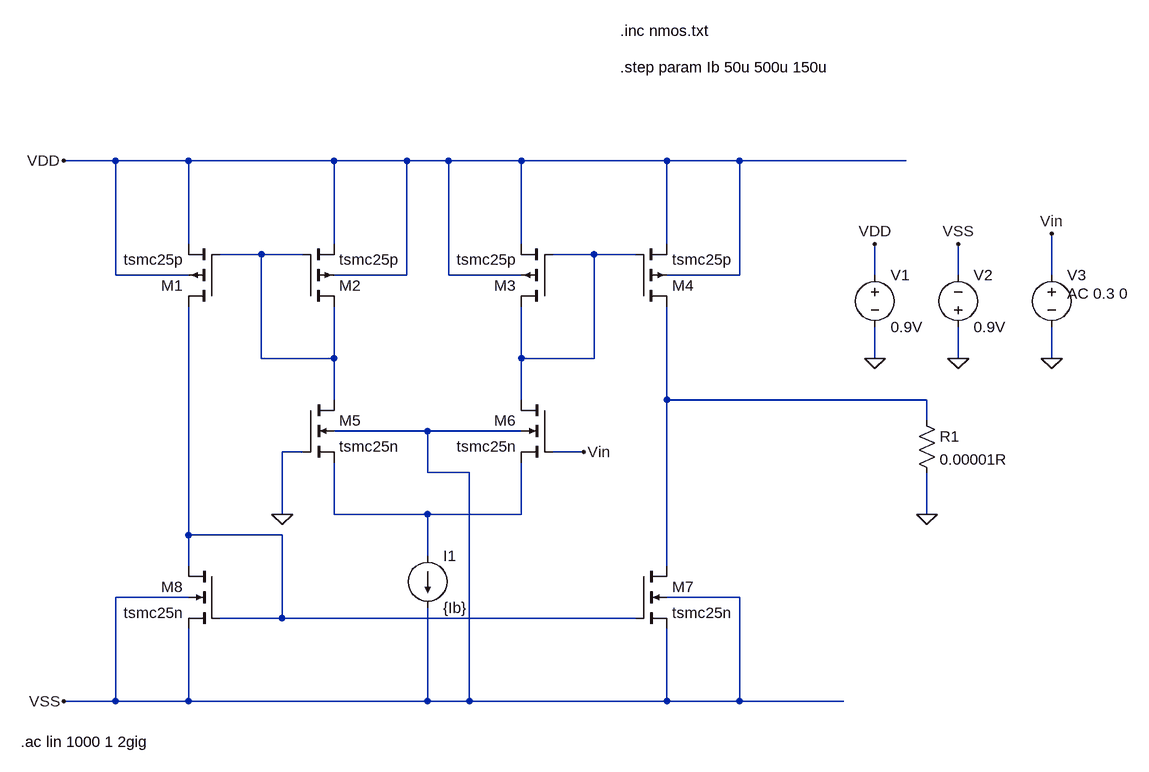
[diagram p0: schematic HW3.asc]
HW3.asc, the LTspice schematic file:
Version 4
SHEET 1 2160 680
WIRE 320 -368 240 -368
WIRE 432 -368 320 -368
WIRE 656 -368 432 -368
WIRE 768 -368 656 -368
WIRE 832 -368 768 -368
WIRE 944 -368 832 -368
WIRE 1168 -368 944 -368
WIRE 1280 -368 1168 -368
WIRE 1536 -368 1280 -368
WIRE 432 -240 432 -368
WIRE 656 -240 656 -368
WIRE 944 -240 944 -368
WIRE 1168 -240 1168 -368
WIRE 544 -224 480 -224
WIRE 608 -224 544 -224
WIRE 1056 -224 992 -224
WIRE 1120 -224 1056 -224
WIRE 320 -192 320 -368
WIRE 432 -192 320 -192
WIRE 768 -192 768 -368
WIRE 768 -192 656 -192
WIRE 832 -192 832 -368
WIRE 944 -192 832 -192
WIRE 1280 -192 1280 -368
WIRE 1280 -192 1168 -192
WIRE 1488 -192 1488 -240
WIRE 1616 -192 1616 -240
WIRE 1760 -192 1760 -256
WIRE 544 -64 544 -224
WIRE 656 -64 656 -144
WIRE 656 -64 544 -64
WIRE 944 -64 944 -144
WIRE 1056 -64 1056 -224
WIRE 1056 -64 944 -64
WIRE 1488 -64 1488 -112
WIRE 1616 -64 1616 -112
WIRE 1760 -64 1760 -112
WIRE 656 0 656 -64
WIRE 944 0 944 -64
WIRE 1168 0 1168 -144
WIRE 1568 0 1168 0
WIRE 1568 32 1568 0
WIRE 800 48 656 48
WIRE 944 48 800 48
WIRE 608 80 576 80
WIRE 1040 80 992 80
WIRE 800 112 800 48
WIRE 864 112 800 112
WIRE 576 176 576 80
WIRE 656 176 656 96
WIRE 800 176 656 176
WIRE 944 176 944 96
WIRE 944 176 800 176
WIRE 1568 176 1568 112
WIRE 432 208 432 -144
WIRE 576 208 432 208
WIRE 800 240 800 176
WIRE 432 256 432 208
WIRE 1168 256 1168 0
WIRE 432 304 320 304
WIRE 1280 304 1168 304
WIRE 576 336 576 208
WIRE 576 336 480 336
WIRE 1120 336 576 336
WIRE 320 464 320 304
WIRE 320 464 240 464
WIRE 432 464 432 352
WIRE 432 464 320 464
WIRE 800 464 800 320
WIRE 800 464 432 464
WIRE 864 464 864 112
WIRE 864 464 800 464
WIRE 1168 464 1168 352
WIRE 1168 464 864 464
WIRE 1280 464 1280 304
WIRE 1280 464 1168 464
WIRE 1440 464 1280 464
FLAG 1488 -64 0
FLAG 1616 -64 0
FLAG 1488 -240 VDD
FLAG 1616 -240 VSS
FLAG 240 -368 VDD
FLAG 576 176 0
FLAG 240 464 VSS
FLAG 1760 -64 0
FLAG 1568 176 0
FLAG 1760 -256 Vin
FLAG 1040 80 Vin
SYMBOL voltage 1488 -208 R0
WINDOW 123 0 0 Left 0
WINDOW 39 0 0 Left 0
SYMATTR InstName V1
SYMATTR Value 0.9V
SYMBOL voltage 1616 -96 M180
WINDOW 0 24 96 Left 2
WINDOW 3 24 16 Left 2
WINDOW 123 0 0 Left 0
WINDOW 39 0 0 Left 0
SYMATTR InstName V2
SYMATTR Value 0.9V
SYMBOL pmos4 480 -144 R180
SYMATTR InstName M1
SYMATTR Value tsmc25p
SYMATTR Value2 l=0.18u w=120u
SYMBOL pmos4 608 -144 M180
SYMATTR InstName M2
SYMATTR Value tsmc25p
SYMATTR Value2 l=0.18u w=30u
SYMBOL pmos4 992 -144 R180
SYMATTR InstName M3
SYMATTR Value tsmc25p
SYMATTR Value2 l=0.18u w=30u
SYMBOL pmos4 1120 -144 M180
SYMATTR InstName M4
SYMATTR Value tsmc25p
SYMATTR Value2 l=0.18u w=120u
SYMBOL nmos4 608 0 R0
SYMATTR InstName M5
SYMATTR Value tsmc25n
SYMATTR Value2 l=0.18u w=100u
SYMBOL nmos4 992 0 M0
SYMATTR InstName M6
SYMATTR Value tsmc25n
SYMATTR Value2 l=0.18u w=100u
SYMBOL current 800 240 R0
WINDOW 123 0 0 Left 0
WINDOW 39 0 0 Left 0
SYMATTR InstName I1
SYMATTR Value {Ib}
SYMBOL nmos4 1120 256 R0
SYMATTR InstName M7
SYMATTR Value tsmc25n
SYMATTR Value2 l=0.18u w=60u
SYMBOL nmos4 480 256 M0
SYMATTR InstName M8
SYMATTR Value tsmc25n
SYMATTR Value2 l=0.18u w=60u
SYMBOL voltage 1760 -208 R0
WINDOW 123 24 44 Left 2
WINDOW 39 0 0 Left 0
SYMATTR Value ""
SYMATTR Value2 AC 0.3 0
SYMATTR InstName V3
SYMBOL res 1552 16 R0
SYMATTR InstName R1
SYMATTR Value 0.00001R
TEXT 1096 -568 Left 2 !.inc nmos.txt
TEXT 1096 -512 Left 2 !.step param Ib 50u 500u 150u
TEXT 174 526 Left 2 !.ac lin 1000 1 2gig

The netlist it stands for:
* HW3.asc
V1 VDD 0 0.9V
V2 0 VSS 0.9V
M1 N005 N001 VDD VDD tsmc25p l=0.18u w=120u
M2 N001 N001 VDD VDD tsmc25p l=0.18u w=30u
M3 N002 N002 VDD VDD tsmc25p l=0.18u w=30u
M4 N003 N002 VDD VDD tsmc25p l=0.18u w=120u
M5 N001 0 N004 VSS tsmc25n l=0.18u w=100u
M6 N002 Vin N004 VSS tsmc25n l=0.18u w=100u
I1 N004 VSS {Ib}
M7 N003 N005 VSS VSS tsmc25n l=0.18u w=60u
M8 N005 N005 VSS VSS tsmc25n l=0.18u w=60u
V3 Vin 0 AC 0.3 0
R1 N003 0 0.00001R
.model NMOS NMOS
.model PMOS PMOS
.lib standard.mos
.inc nmos.txt
.step param Ib 50u 500u 150u
.ac lin 1000 1 2gig
.backanno
.end